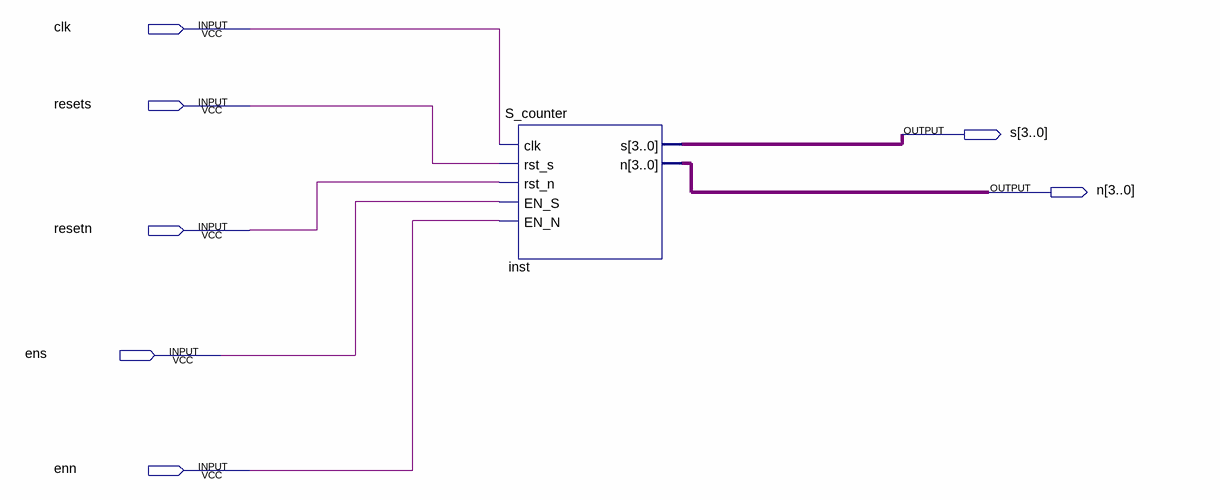
[diagram p0: schematic sheet]
// Quartus schematic counter.bdf as structural Verilog: 1 symbols, 7 pins
module counter (
  input  clk,
  input  resets,
  input  resetn,
  input  ens,
  input  enn,
  output [3:0] s,
  output [3:0] n
);

  S_counter inst (.clk(clk), .rst_s(resets), .rst_n(resetn), .EN_S(ens), .EN_N(enn), .s(s), .n(n));
endmodule
